# Altium schematic sheet WE_1100_top.SchDoc: not used
size A3; Date: not used; Author: not used; CompanyName: Würth Elektronik eiSos GmbH & Co. KG; Engineer: not used; Organization: not used; Address1: Max-Eyth-Str. 1; Address2: 74638 Waldenburg; Address3: not used; Address4: Germany; DocumentNumber: 2; Revision: not used; SheetNumber: 2; SheetTotal: 2; CurrentTime: not used; CurrentDate: not used; Time: not used; DocumentFullPathAndName: not used; ModifiedDate: not used; ImagePath: not used; ProjectName: not used
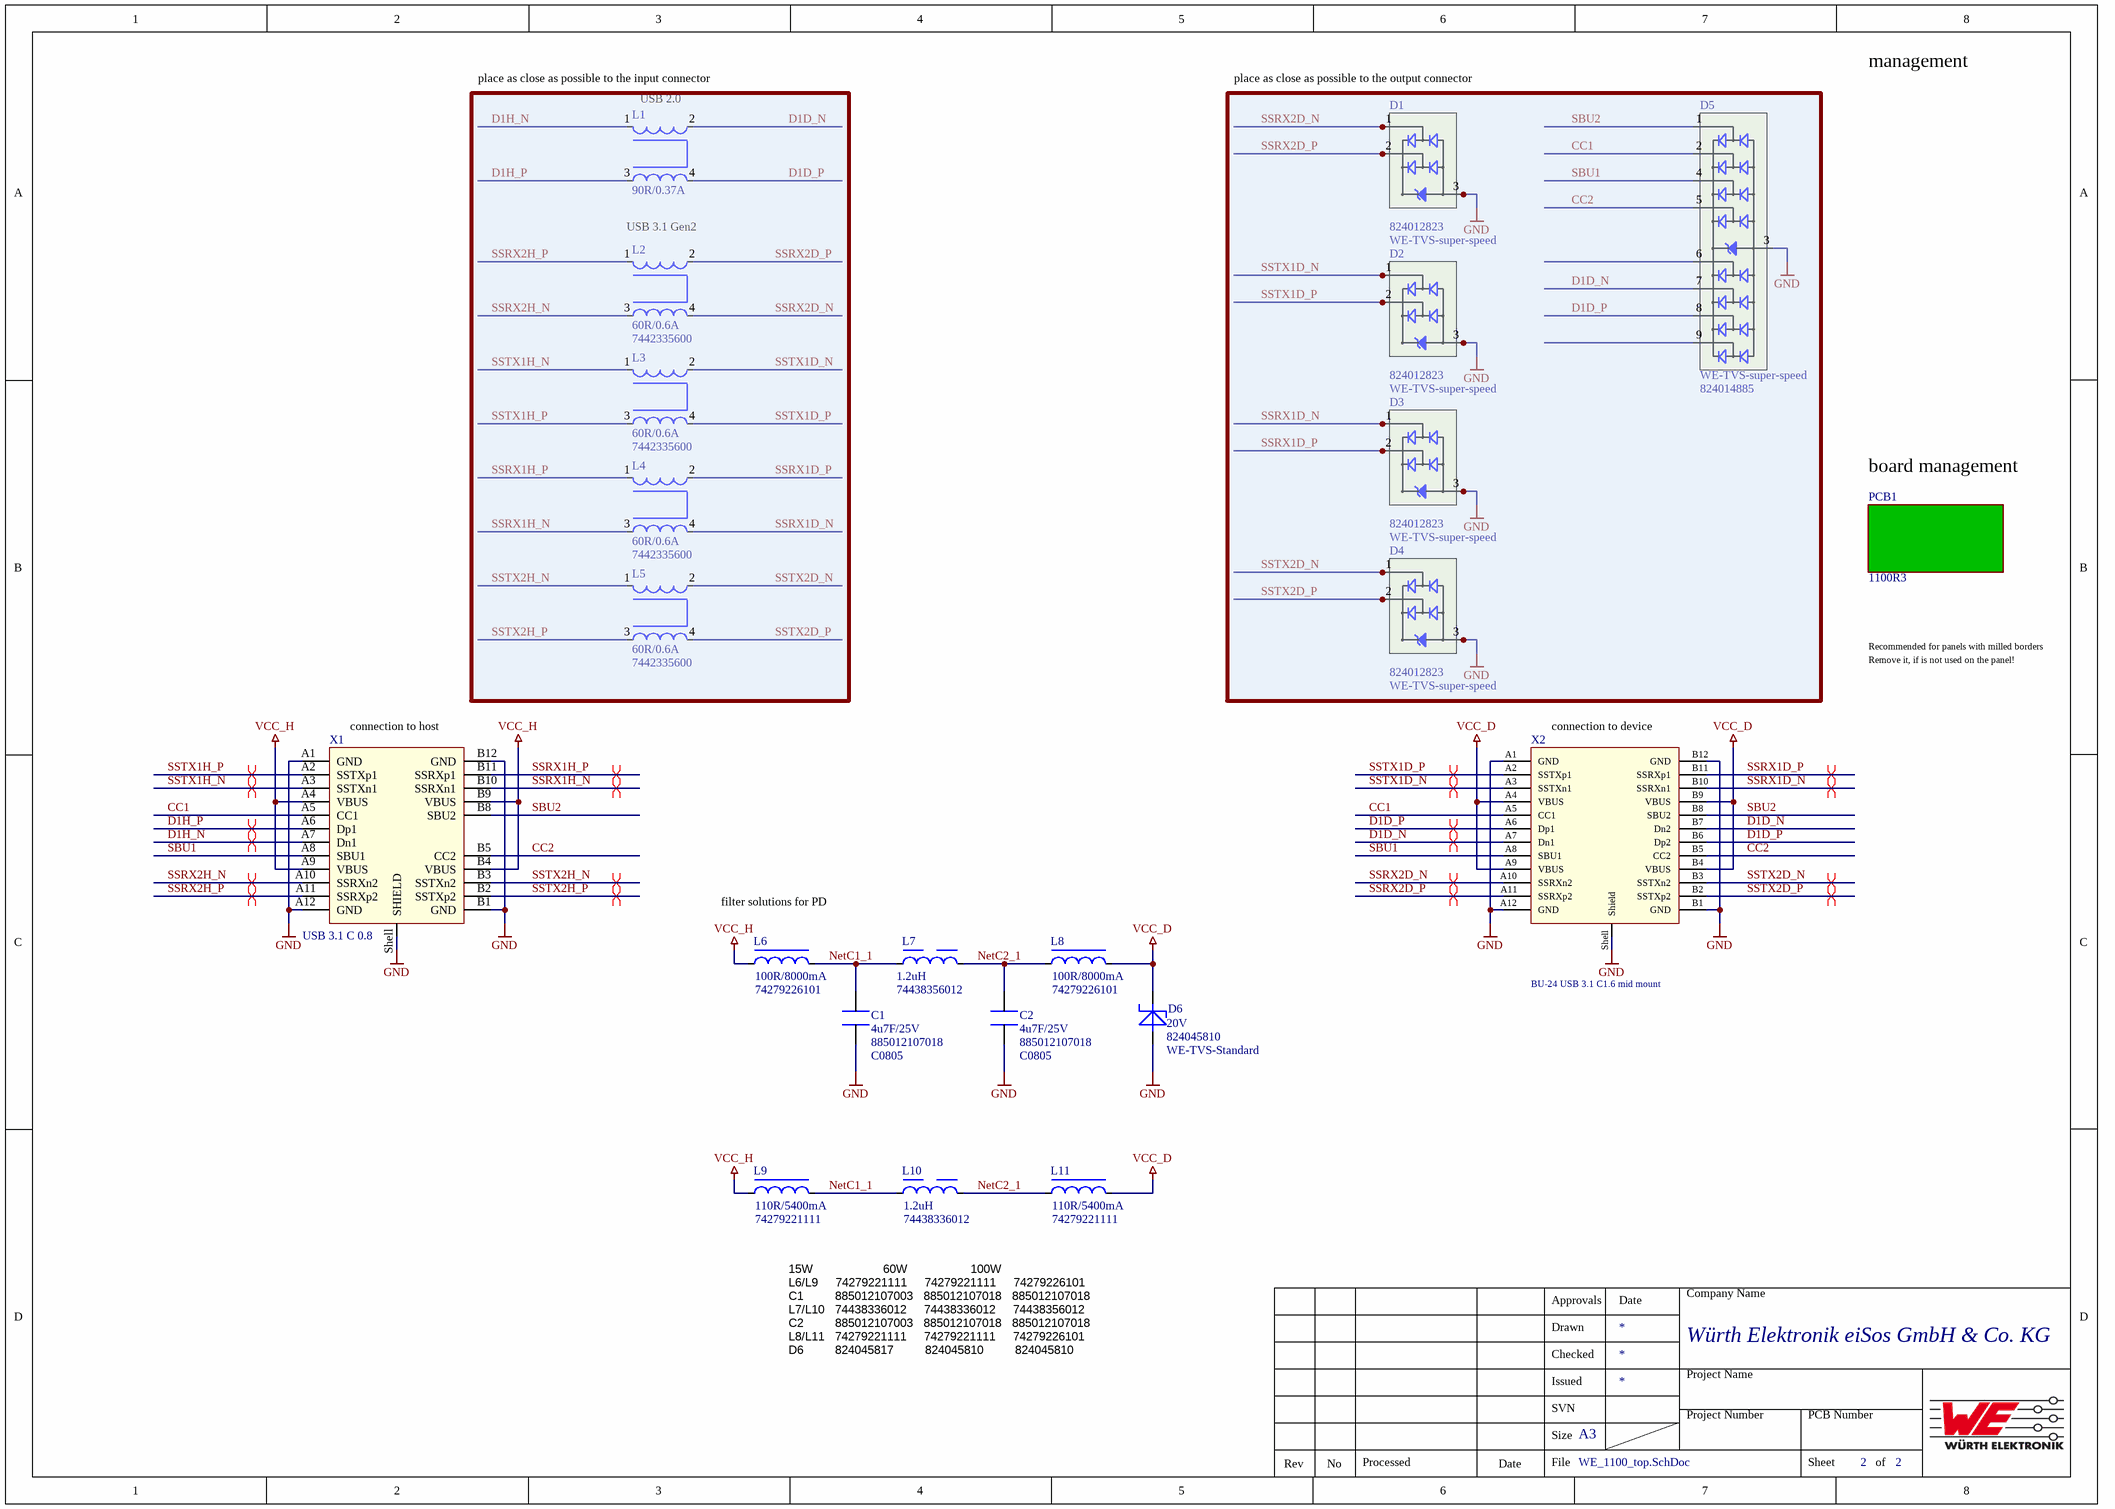
[diagram p0: WE_1100_top.SchDoc]

## Parts
C1  4u7F/25V  Art.-Code: 885012107018  Case: C0805  [C0805 (reflow)]
C2  4u7F/25V  Art.-Code: 885012107018  Case: C0805  [C0805 (reflow)]
D1  WE-TVS-super-speed  Part-No.: 824012823  [DFN88P100X50-6L]
D2  WE-TVS-super-speed  Part-No.: 824012823  [DFN88P100X50-6L]
D3  WE-TVS-super-speed  Part-No.: 824012823  [DFN88P100X50-6L]
D4  WE-TVS-super-speed  Part-No.: 824012823  [DFN88P100X50-6L]
D5  WE-TVS-super-speed  Part-No.: 824014885  [DFN90P380X55-9L]
D6  WE-TVS-Standard  Voltage: 20V  Part-No.: 824045810  [DFN110P160X55-2L]
L1  90R/0.37A  [WE-CNSW-0805 (REFLOW)]
L2  60R/0.6A  Part-No.: 7442335600  [WE-CNSW-HF-0504 (REFLOW)]
L3  60R/0.6A  Part-No.: 7442335600  [WE-CNSW-HF-0504 (REFLOW)]
L4  60R/0.6A  Part-No.: 7442335600  [WE-CNSW-HF-0504 (REFLOW)]
L5  60R/0.6A  Part-No.: 7442335600  [WE-CNSW-HF-0504 (REFLOW)]
L6  100R/8000mA  Art.-Code: 74279226101  [WE-MPSB_1812]
L7  1.2uH  Art.-Code: 74438356012  [WE-MAPI_4020]
L8  100R/8000mA  Art.-Code: 74279226101  [WE-MPSB_1812]
L9  110R/5400mA  Art.-Code: 74279221111  [WE-MPSB_1206]
L10  1.2uH  Art.-Code: 74438336012  [WE-MAPI_3020]
L11  110R/5400mA  Art.-Code: 74279221111  [WE-MPSB_1206]
PCB1  1100R3  (mechanical)
X1  USB 3.1 C 0.8  [632712000011]
X2  BU-24 USB 3.1 C1.6 mid mount  [632723130112]

## Blocks framed on the sheet
place as close as possible to the output connector: D1-D5

## Nets
GND: C1.2 C2.2 D1.3(VDD) D1.4(VDD) D2.3(VDD) D2.4(VDD) D3.3(VDD) D3.4(VDD) D4.3(VDD) D4.4(VDD) D5.3(VDD) D6.2(I/O2) X1.A1(GND) X1.A12(GND) X1.B1(GND) X1.B12(GND) X1.Shell(SHIELD) X2.A1(GND) X2.A12(GND) X2.B1(GND) X2.B12(GND) X2.Shell(Shield)
VCC_D: D6.1(I/O1) L8.2 L11.2 X2.A4(VBUS) X2.A9(VBUS) X2.B4(VBUS) X2.B9(VBUS)
VCC_H: L6.1 L9.1 X1.A4(VBUS) X1.A9(VBUS) X1.B4(VBUS) X1.B9(VBUS)
CC1: D5.2(I/O2) X1.A5(CC1) X2.A5(CC1)
CC2: D5.5(I/O4) X1.B5(CC2) X2.B5(CC2)
D1D_N: D5.7(NC) L1.2 X2.A7(Dn1) X2.B7(Dn2)
D1D_P: D5.8(GND) L1.4 X2.A6(Dp1) X2.B6(Dp2)
D1H_N: L1.1 X1.A7(Dn1)
D1H_P: L1.3 X1.A6(Dp1)
NetC1_1: C1.1 L6.2 L7.1 L9.2 L10.1
NetC2_1: C2.1 L7.2 L8.1 L10.2 L11.1
SBU1: D5.4(I/O3) X1.A8(SBU1) X2.A8(SBU1)
SBU2: D5.1(I/O1) X1.B8(SBU2) X2.B8(SBU2)
SSRX1D_N: D3.1(I/O1) D3.6(I/O1) L4.4 X2.B10(SSRXn1)
SSRX1D_P: D3.2(I/O2) D3.5(I/O2) L4.2 X2.B11(SSRXp1)
SSRX1H_N: L4.3 X1.B10(SSRXn1)
SSRX1H_P: L4.1 X1.B11(SSRXp1)
SSRX2D_N: D1.1(I/O1) D1.6(I/O1) L2.4 X2.A10(SSRXn2)
SSRX2D_P: D1.2(I/O2) D1.5(I/O2) L2.2 X2.A11(SSRXp2)
SSRX2H_N: L2.3 X1.A10(SSRXn2)
SSRX2H_P: L2.1 X1.A11(SSRXp2)
SSTX1D_N: D2.1(I/O1) D2.6(I/O1) L3.2 X2.A3(SSTXn1)
SSTX1D_P: D2.2(I/O2) D2.5(I/O2) L3.4 X2.A2(SSTXp1)
SSTX1H_N: L3.1 X1.A3(SSTXn1)
SSTX1H_P: L3.3 X1.A2(SSTXp1)
SSTX2D_N: D4.1(I/O1) D4.6(I/O1) L5.2 X2.B3(SSTXn2)
SSTX2D_P: D4.2(I/O2) D4.5(I/O2) L5.4 X2.B2(SSTXp2)
SSTX2H_N: L5.1 X1.B3(SSTXn2)
SSTX2H_P: L5.3 X1.B2(SSTXp2)

Not connected (* = marked no-connect by the designer): D5 6(NC) 9(NC)

## Layout directives
differential pair: D1D_N, D1D_P, D1H_N, D1H_P, SSRX1D_N, SSRX1D_P, SSRX1H_N, SSRX1H_P, SSRX2D_N, SSRX2D_P, SSRX2H_N, SSRX2H_P, SSTX1D_N, SSTX1D_P, SSTX1H_N, SSTX1H_P, SSTX2D_N, SSTX2D_P, SSTX2H_N, SSTX2H_P

## Notes on the sheet
- (near L1) place as close as possible to the input connector
- (near L1) USB 2.0
- management
- USB 3.1 Gen2
- (near PCB1) board management
- Recommended for panels with milled borders
- Remove it, if is not used on the panel!
- (near X1) connection to host
- (near X2) connection to device
- filter solutions for PD
- 15W                    60W                  100W
  L6/L9     74279221111     74279221111     74279226101
  C1         885012107003   885012107018   885012107018
  L7/L10   74438336012     74438336012     74438356012
  C2         885012107003   885012107018   885012107018
  L8/L11   74279221111     74279221111     74279226101
  D6         824045817         824045810         824045810
- Approvals
- Date
- Company Name
- Drawn
- Checked
- Issued
- Project Name
- Rev
- No
- Size
- SVN
- A3
- Project Number
- PCB Number
- Processed
- File
- Sheet
- of

## Library data of the parts
C1 C2 = 4UF7/25-X5R-0805: Ceramic SMT X5R 4,7uF/25V 0805; Part-No.: X5R0805475M025DFCT10000; Manufacturer: WE; Value: 4.7u; Group: C-KERKO; Tolerance: 20%; TK: 15%; Voltage: 25V; Type: WCAP-CSGP; Obligation: no; HelpURL: d:\Hardware\Datasheet\Kondensatoren\WCAP-CSGP\885012107018.pdf; Value1: 4u7F/25V; Dielectric: X5R; Temperature: -55°C - +85°C; ComponentLink1URL: http://katalog.we-online.de/pbs/datasheet/885012107018.pdf; ComponentLink1Description: Datasheet
D1-D4 = WE-TVS-ULC-DFN1012-6: TVS, diode, array, 2 channel ESD protection, 3.3V, DFN1012-6; Manufacturer: WE; Group: D-DIODE; Obligation: no; Type: TVS Diode; Art.-Code: 824012823; Case: DFN1012; MSL: 3; Preferred Device: no; Value1: WE-TVS-super-speed; Voltage: 3.3V; HelpURL: d:\Hardware\Datasheet\Diode\WE_824xx_TVS_AZ1023-02F_Preliminary.pdf
D5 = WE-TVS-ULC-DFN3810: TVS, diode, array, 8 channel ESD protection, 1.2V, DFN3810-9; Manufacturer: WE; Group: D-DIODE; Obligation: no; Type: TVS Diode; Art.-Code: 824014885; Case: DFN3810; MSL: 3; Preferred Device: no; Value1: WE-TVS-super-speed; Voltage: 1.2V; HelpURL: d:\Hardware\Datasheet\Diode\WE_824xx_TVS_AZ124S-08F_Preliminary.pdf
D6 = WE-TVS20-ULC-DFN1610: TVS, diode, unidir, ESD protection, 20V, DFN1610; Manufacturer: WE; Group: D-DIODE; Obligation: no; Type: TVS Diode; Art.-Code: 824045810; Case: DFN1610; MSL: 3; Preferred Device: no; Value1: WE-TVS-Standard; HelpURL: d:\Hardware\Datasheet\Diode\WE_824xx_TVS_AZ4520-01F_Datasheet.pdf; ComponentLink1URL: http://katalog.we-online.de/pbs/datasheet/824045810.pdf; ComponentLink1Description: Datasheet
L1 = Z90R-370mA-WE-CNSW: Common mode line filter SMD WE-CNSW (USB, LVDS); Manufacturer: WE; Art.-Code: 744231091; Group: L-SPULE; Current: 370mA; Tolerance: 25%; Value: 90R; Voltage: 50VDC; Type: WE-CNSW 0805; Obligation: no; Case: C0805; HelpURL: d:\Hardware\Datasheet\Induktivitäten\WE-CNSW\744231091.pdf; Part-No.: 744231091; Temperature: -40°C - +125°C; Value1: 90R/0.37A; MSL: 1
L2-L5 = Z60R-600mA-WE-CNSW HF: Common mode line filter SMD WE-CNSW HF (USB3.0); Manufacturer: WE; Group: L-SPULE; Current: 600mA; Tolerance: 25%; Value: 60R; Voltage: 20VDC; Type: WE-CNSW HF 0504; Obligation: no; Art.-Code: 7442335600; Case: C0504; HelpURL: d:\Hardware\Datasheet\Induktivitäten\WE-CNSW_HF\7442335600.pdf; Temperature: -40°C - +105°C; Value1: 60R/0.6A; MSL: 1; ComponentLink1URL: http://katalog.we-online.de/pbs/datasheet/7442335600.pdf
L6 L8 = Z100R_8000mA_1812_MPSB: Multilayer Power Suppression Bead 1812 100R at 100MHz/0.006R; Manufacturer: WE; Group: L-FERRIT; Current: 8000mA; Tolerance: 25%; Voltage: 80VDC; Type: WE-MPSB; Obligation: no; Value: 100R; Case: C1812; Value1: 100R/8000mA; HelpURL: d:\Hardware\Datasheet\Induktivitäten\Ferrit\74279226101.pdf; Part-No.: 74279226101; Temperature: -55°C - +125°C; ComponentLink1URL: https://katalog.we-online.de/pbs/datasheet/74279226101.pdf; ComponentLink1Description: Datasheet
L7 = 1UH2-5.8A-SMD-WE-MAPI 4020: Inductor SMT WE-MAPI 4020 1.2uH/5800mA; Manufacturer: WE; Current: 5.8A; Group: L-SPULE; Obligation: no; Tolerance: 20%; Value: 1u2; Voltage: 80VDC; Case: SMD 4020; HelpURL: d:\Hardware\Datasheet\Induktivitäten\WE-MAPI\74438356012.pdf; MSL: 1; Part-No.: 74438356012; Temperature: -40°C - +125°C; Type: WE-MAPI 4020; Value1: 1.2uH; ComponentLink1URL: https://katalog.we-online.de/pbs/datasheet/74438356012.pdf; ComponentLink1Description: Datasheet
L9 L11 = Z110R_5400mA_1206_MPSB: Multilayer Power Suppression Bead 1206 110R at 100MHz/0.0095R; Manufacturer: WE; Group: L-FERRIT; Current: 5400mA; Tolerance: 25%; Voltage: 80VDC; Type: WE-MPSB; Obligation: no; Value: 110R; Case: C1206; Value1: 110R/5400mA; HelpURL: d:\Hardware\Datasheet\Induktivitäten\Ferrit\74279221111.pdf; Part-No.: 74279221111; Temperature: -55°C - +125°C; ComponentLink1URL: https://katalog.we-online.de/pbs/datasheet/74279221111.pdf; ComponentLink1Description: Datasheet
L10 = 1UH2-3.9A-SMD-WE-MAPI 3020: Inductor SMT WE-MAPI 3020 1.2uH/3900mA; Manufacturer: WE; Current: 3.9A; Group: L-SPULE; Obligation: no; Tolerance: 20%; Value: 1u2; Voltage: 80VDC; Case: SMD 3020; HelpURL: d:\Hardware\Datasheet\Induktivitäten\WE-MAPI\74438336012.pdf; Part-No.: 74438336012; Temperature: -40°C - +125°C; Type: WE-MAPI 3020; Value1: 1.2uH; ComponentLink1URL: https://katalog.we-online.de/pbs/datasheet/74438336012.pdf; ComponentLink1Description: Datasheet
PCB1 = PCB: only for partlist; Art.-Code: NA; Obligation: no; Value1: 1100R3
X1 = ST-24 USB 3.1 C 0.8: male USB 3.1 Type C 24 pins 90° THT & SMT LP 0.8; Manufacturer: WE; Current: 5A; Group: X-STECKER; UL File: E323964; Voltage: 20V; Art.-Code: 632712000011; Case: USB C; HelpURL: d:\Hardware\Datasheet\Steckverbinder\we_632712000011_USB_3.1_male_Type_C_LP0.8.pdf; Part-No.: 632712000011; Temperature: -25°C - +105°C; Type: USB C male; Value1: USB 3.1 C 0.8; ComponentLink1URL: http://katalog.we-online.de/em/datasheet/632712000011.pdf; ComponentLink1Description: Datasheet
X2 = BU-24 USB 3.1 C1.6 mid mount: USB 3.1 Type C Receptacle WR-COM, Horizontal, THR / SMT; Manufacturer: WE; Current: 5A; Group: X-BUCHSE; Obligation: yes; Voltage: 20V; ComponentLink1Description: Datasheet; ComponentLink1URL: https://katalog.we-online.de/em/datasheet/632723130112.pdf; Art.-Code: 632723130112; Case: USB-C; HelpURL: d:\Hardware\Datasheet\Steckverbinder\we_632723130112_USB_3.1_female_Type_C_LP1.6.pdf; Part-No.: 632723130112; Temperature: -40°C - +85°C; Type: USB C female; Value1: USB 3.1 C 1.6; Value: mid mount